# EAGLE design tvbgone3 (EAGLE 5.11)
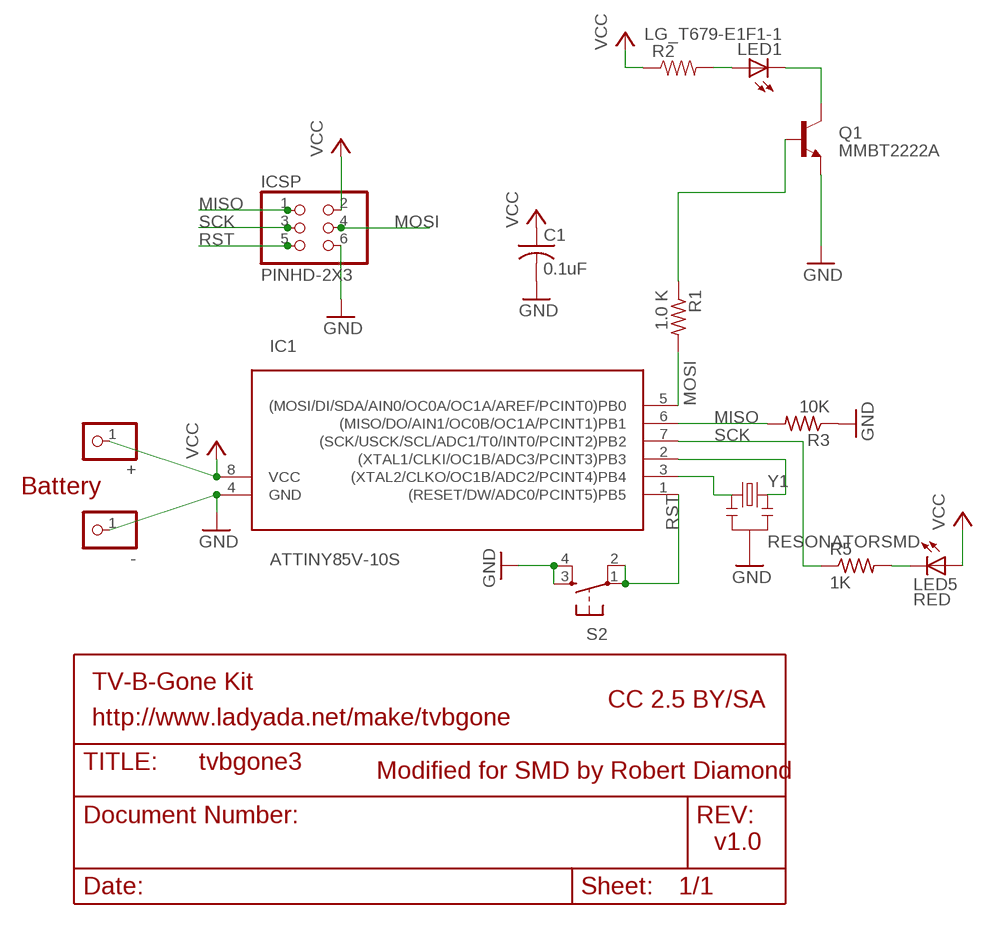
[diagram p0: schematic, sheet 1]

## Parts
+  PINHD-1X1  [1X01]
-  PINHD-1X1  [1X01]
C1  0.1uF  C-USC0603  [C0603]
IC1  ATTINY85V-10S  [SOIC8]
ICSP  PINHD-2X3  [2X3SMT]
LED1  LG_T679-E1F1-1  [PLCC2]
LED5  RED  LEDCHIP-LED0603  [CHIP-LED0603]
Q1  MMBT2222A  TRANSISTOR_NPNSOT23  [SOT23]
R1  1.0 K  R-US_R0603  [R0603]
R2  RESISTOR1206  [1206]
R3  10K  R-US_R0603  [R0603]
R5  1K  R-US_R0603  [R0603]
S2  TAC_SWITCHSMD  [TACTILE_SWITCH_SMD]
Y1  RESONATORSMD  [RESONATOR-SMD]

## Nets
GND: -.1 C1.2 IC1.4(GND) ICSP.6 Q1.2(E) R3.1 S2.3 S2.4 Y1.2
MISO: IC1.6((MISO/DO/AIN1/OC0B/OC1A/PCINT1)PB1) ICSP.1 R3.2
MOSI: IC1.5((MOSI/DI/SDA/AIN0/OC0A/OC1A/AREF/PCINT0)PB0) ICSP.4 R1.2
N$1: IC1.3((XTAL2/CLKO/OC1B/ADC2/PCINT4)PB4) Y1.1
N$2: IC1.2((XTAL1/CLKI/OC1B/ADC3/PCINT3)PB3) Y1.3
N$3: LED5.C R5.2
N$4: LED1.C Q1.3(C)
N$6: Q1.1(B) R1.1
N$7: LED1.A R2.2
RST: IC1.1((RESET/DW/ADC0/PCINT5)PB5) ICSP.5 S2.1 S2.2
SCK: IC1.7((SCK/USCK/SCL/ADC1/T0/INT0/PCINT2)PB2) ICSP.3 R5.1
VCC: +.1 C1.1 IC1.8(VCC) ICSP.2 LED5.A R2.1

## Notes on the sheet
- Battery
- TV-B-Gone Kit
- CC 2.5 BY/SA
- http://www.ladyada.net/make/tvbgone
- Modified for SMD by Robert Diamond
- v1.0

## Library data of the parts
+ - = ybox2:PINHD-1X1: PIN HEADER
C1 = rcl-ez:C-US: CAPACITOR, American symbol
IC1 = avr:ATTINY85: MICROCONTROLLER 8 Kbytes FLASH 512 bytes EEPROM 512 bytes RAM 4-channel 10 bit ADC USI
ICSP = adaprog:PINHD-2X3
LED1 = led:*_T679-?-1: LC TOPLED® Low Current LED Source: http://catalog.osram-os.com .. LG_LS_LY_T679_OBS.pdf; COLOR: green
LED5 = minimidi:LED: LED OSRAM: - CHIPLED LG R971, LG N971, LY N971, LG Q971, LY Q971, LO R971, LY R971 LH N974, LH R974 LS Q976, LO Q976, LY Q976 LO Q996 - Hyper CHIPLED LW Q18S LB Q993, LB Q99A, LB R99A - SideLED LS A670, LO A670, LY A670, LG A670, LP A670 LB A673, LV A673, LT A673, LW A673 LH A674 LY A675 LS A676, LA A676, LO A676, LY A676, LW A676 LS A679, LY A679, LG A679 - Hyper Micro SIDELED® LS Y876, LA Y876, LO Y876, LY Y876 LT Y87S - SmartLED LW L88C, LW L88S LB L89C, LB L89S, LG L890 LS L89K, LO L89K, LY L89K LS L896, LA L896, LO L896, LY L896 - TOPLED LS T670, LO T670, LY T670, LG T670, LP T670 LSG T670, LSP T670, LSY T670, LOP T670, LYG T670 LG T671, LOG T671, LSG T671 LB T673, LV T673, LT T673, LW T673 LH T674 LS T676, LA T676, LO T676, LY T676, LB T676, LH T676, LSB T676, LW T676 LB T67C, LV T67C, LT T67C, LS T67K, LO T67K, LY T67K, LW E67C LS E67B, LA E67B, LO E67B, LY E67B, LB E67C, LV E67C, LT E67C LW T67C LS T679, LY T679, LG T679 LS T770, LO T770, LY T770, LG T770, LP T770 LB T773, LV T773, LT T773, LW T773 LH T774 LS E675, LA E675, LY E675, LS T675 LS T776, LA T776, LO T776, LY T776, LB T776 LHGB T686 LT T68C, LB T68C - Hyper Mini TOPLED® LB M676 - Mini TOPLED Santana® LG M470 LS M47K, LO M47K, LY M47K Source: http://www.osram.convergy.de/
Q1 = SparkFun:TRANSISTOR_NPN: Transistor NPN BJT configuration in SOT23 package. MMBT2222 is the common NPN we use. Double check BCE configuration again layout.
R1 R3 R5 = rcl-ez:R-US_: RESISTOR, American symbol
R2 = SparkFun:RESISTOR: Resistor Basic schematic elements and footprints for 0603, 1206, and PTH 1/10th watt (small) resistors.
S2 = SparkFun:TAC_SWITCH: Momentary Switch Button commonly used for reset or general input. Spark Fun Electronics SKU : COM-00097
Y1 = SparkFun:RESONATOR: Resonator Small SMD resonator. This is the itty bitty 10/20MHz resonators with built in caps. CSTCE10M0G55 and CSTCE20M0V53. Footprint has been reviewed closely but hasn't been tested yet.

## Board
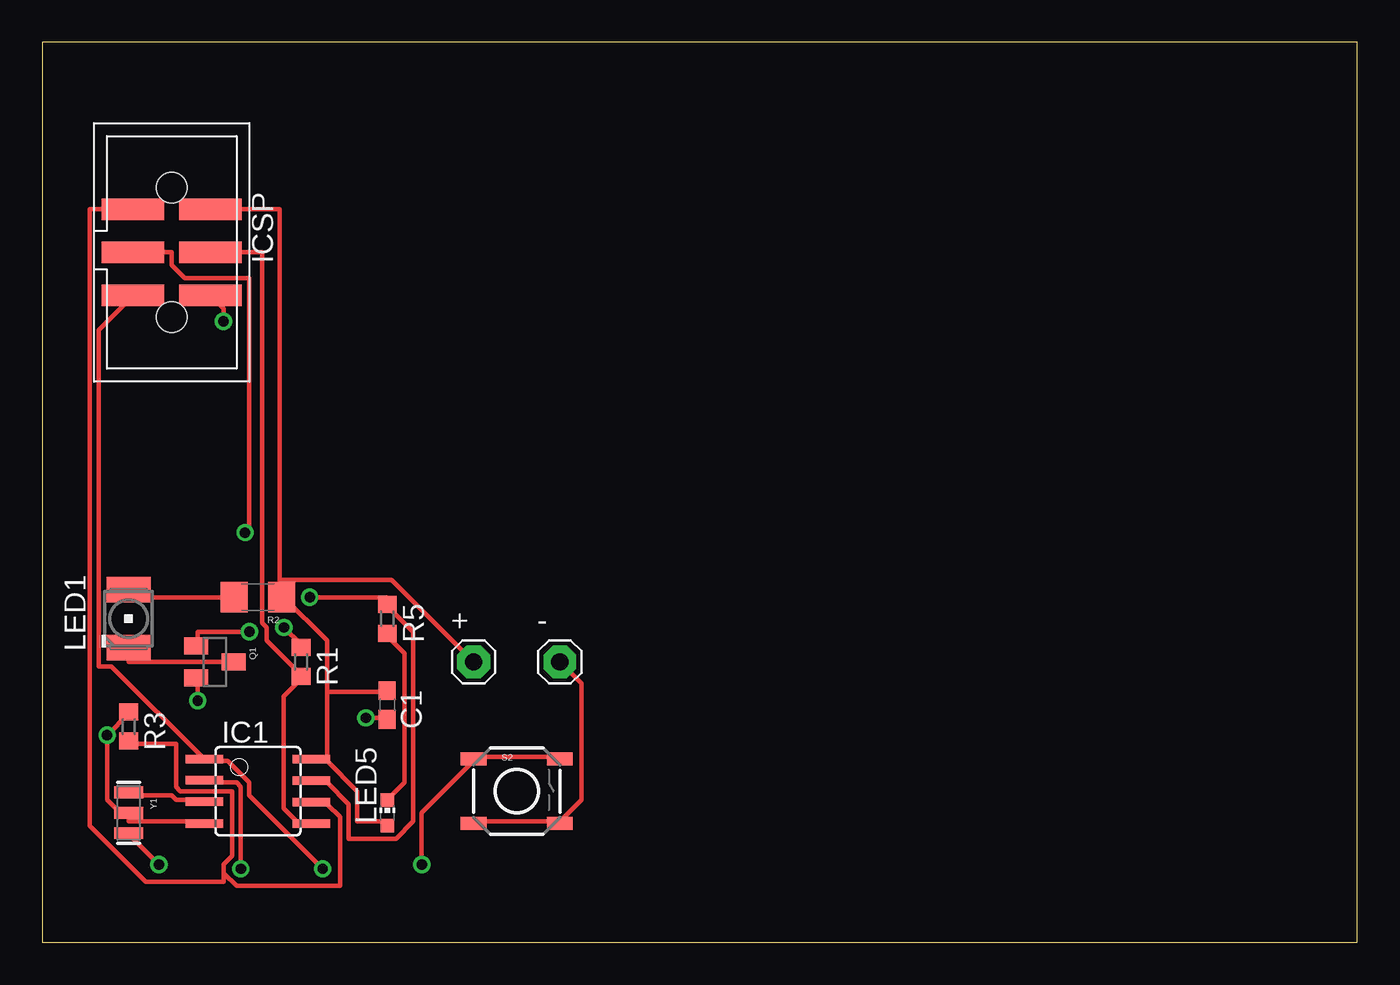
[diagram p1: board, top side]
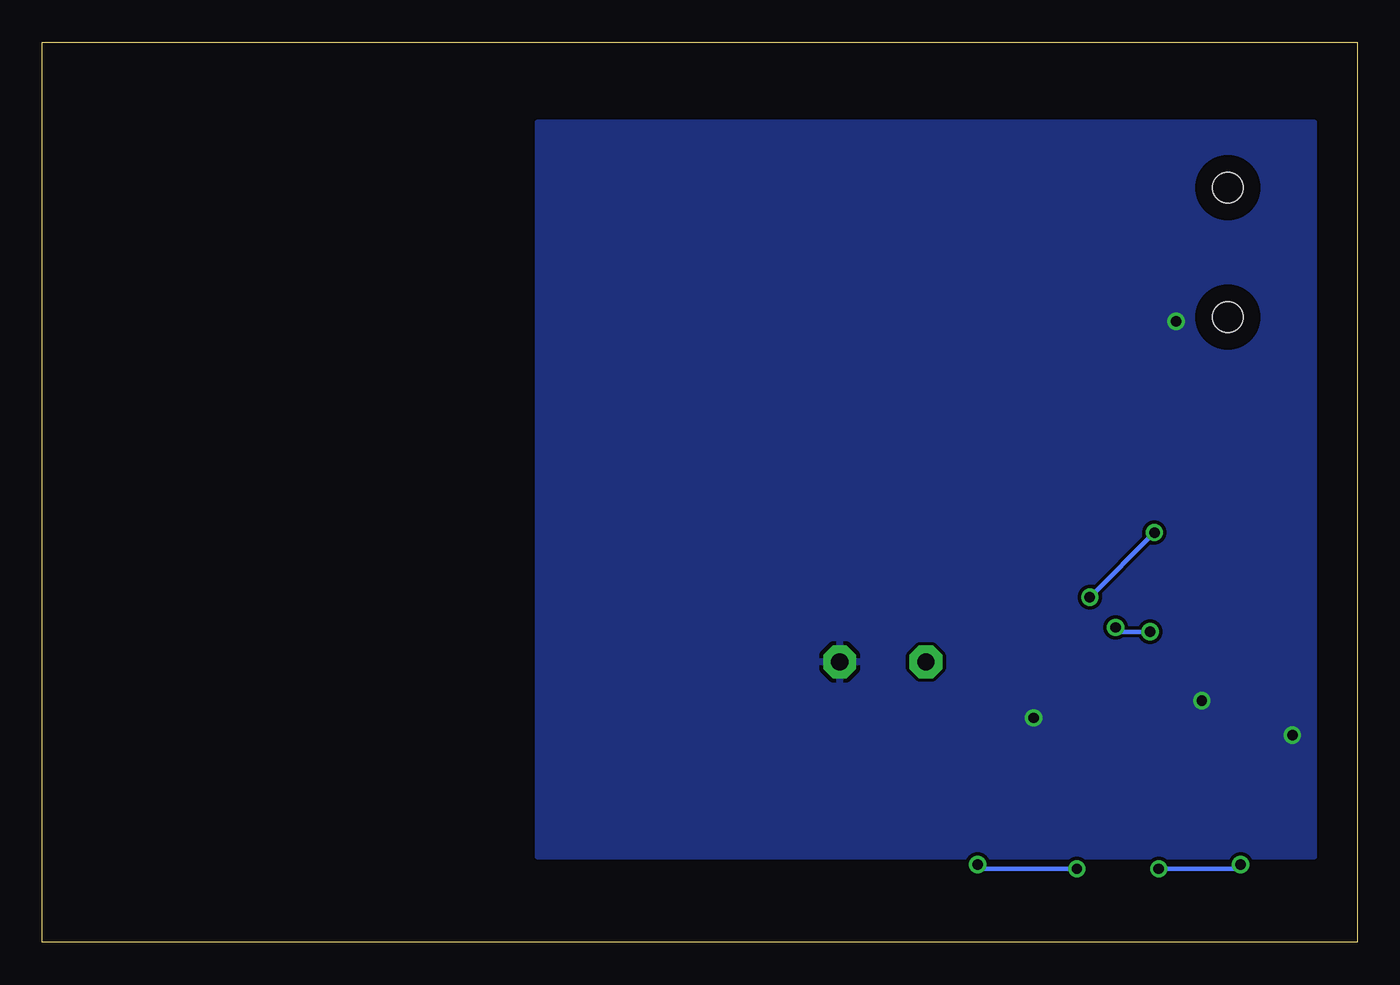
[diagram p2: board, bottom side, seen from below]

Size 77.45 x 53.01 mm. Coordinates in mm from the lower left corner, seen from the top.
Outline: 0,0 77.45,0 77.45,53.01 0,53.01 0,0
Copper layers (1*16): Top 0.035mm / dielectric 1.5mm / Bottom 0.035mm
Design rules "default": minimum track width 10mil, minimum drill 24mil, track to track 8mil, track to pad 8mil, pad to pad 8mil, via to via 8mil, smd to smd 8mil, copper to edge 40mil, drill to drill 8mil, minimum pad ring 10mil, minimum via ring 8mil, stop-mask expansion 4mil, vias tented up to drill 0mil, thermal gap 10mil

### Footprints (pad centres in the part's own frame; a part is rotated, then mirrored left to right if it is on the bottom)
1X01 = drill 1.016 pad 1.93 octagon: 1 0,0
C0603 = smd 1.1 x 1: 1 -0.85,0; 2 0.85,0
SOIC8 = smd 0.5 x 2.2: 1 -1.905,-3.154; 2 -0.645,-3.154; 3 0.625,-3.154; 4 1.895,-3.154; 5 1.905,3.154; 6 0.635,3.154; 7 -0.635,3.154; 8 -1.905,3.154
2X3SMT = smd 1.27 x 3.683: 1 -2.54,-2.286; 2 -2.54,2.286; 3 0,-2.286; 4 0,2.286; 5 2.54,-2.286; 6 2.54,2.286 | hole 1.778: -3.81,0; 3.81,0
PLCC2 = smd 2.6 x 1.5: A 0,1.7; C 0,-1.7
CHIP-LED0603 = smd 0.8 x 0.8: A 0,-0.75; C 0,0.75
SOT23 = smd 1 x 1.4: 1 -0.95,-1.1; 2 0.95,-1.1; 3 0,1.1
R0603 = smd 1 x 1.1: 1 -0.85,0; 2 0.85,0
1206 = smd 1.6 x 1.8: 1 -1.4,0; 2 1.4,0
TACTILE_SWITCH_SMD = smd 1.524 x 0.762: 1 -2.54,1.905; 2 2.54,1.905; 3 -2.54,-1.905; 4 2.54,-1.905
RESONATOR-SMD = smd 0.7 x 1.7: 1 -1.2,0; 2 0,0; 3 1.2,0

### Placement (x,y rotation side)
+  25.4,16.51 0 top
-  30.48,16.51 0 top
C1  20.32,13.97 270 top
IC1  12.7,8.89 270 top
ICSP  7.62,40.64 270 top
LED1  5.08,19.05 0 top
LED5  20.32,7.62 0 top
Q1  10.16,16.51 270 top
R1  15.24,16.51 270 top
R2  12.7,20.32 180 top
R3  5.08,12.7 270 top
R5  20.32,19.05 270 top
S2  27.94,8.89 0 top
Y1  5.08,7.62 270 top

### Tracks (layer width: path | path; a pad name or v marks a point on that pad's centre or on a via)
GND  (via drill 0.61)
  Top 0.254: R3.1 5.08,13.46 v3.81,12.19 3.81,8.38 4.57,7.62 Y1.2 5.08,7.11 9.4,7.11 IC1.4 | 30.48,7.11 25.4,7.11 S2.3 | v19.05,13.21 20.32,13.21 C1.2 | v9.14,14.22 9.14,15.49 Q1.2 | 30.48,7.11 31.75,8.38 31.75,15.24 -.1 | 30.48,7.11 S2.4 | ICSP.6 10.67,37.34 v10.67,36.58
  pour Bottom: 2.54,48.26 48.26,48.26 48.26,5.08 2.54,5.08
MISO
  Top 0.254: 10.67,4.06 10.67,4.57 11.18,5.08 11.18,8.89 8.13,8.89 7.87,9.14 7.87,11.68 5.08,11.68 R3.2 | 10.67,4.06 11.43,3.3 17.53,3.3 17.53,7.37 16.76,8.13 16,8.13 IC1.6 | ICSP.1 2.79,43.18 2.79,6.86 6.1,3.56 10.67,3.56 10.67,4.06
MOSI
  Top 0.254: IC1.5 15.75,7.11 14.99,7.11 14.22,7.87 14.22,14.48 15.24,15.49 R1.2 15.24,15.75 13.21,17.78 13.21,18.54 12.95,18.8 12.95,40.64 ICSP.4
N$1
  Top 0.254: Y1.1 5.08,8.64 7.62,8.64 7.87,8.38 9.4,8.38 IC1.3
N$2  (via drill 0.61)
  Top 0.254: v6.86,4.57 5.08,6.35 Y1.3 | v11.68,4.32 11.68,9.14 11.43,9.4 9.65,9.4 IC1.2
  Bottom 0.254: v6.86,4.57 7.11,4.32 v11.68,4.32
N$3
  Top 0.254: LED5.C 20.32,8.38 21.34,9.4 21.34,17.02 20.32,18.03 R5.2
N$4
  Top 0.254: Q1.3 5.08,16.51 LED1.C
N$6  (via drill 0.61)
  Top 0.254: v14.22,18.54 15.24,17.53 R1.1 | v12.19,18.29 9.14,18.29 9.14,17.53 Q1.1
  Bottom 0.254: v14.22,18.54 13.97,18.29 v12.19,18.29
N$7
  Top 0.254: R2.2 5.08,20.32 LED1.A
RST  (via drill 0.61)
  Top 0.254: S2.2 30.48,10.92 25.4,10.92 S2.1 25.4,10.67 22.35,7.62 v22.35,4.57 | ICSP.5 3.3,36.07 3.3,16.26 4.06,16.26 9.4,10.92 IC1.1 9.65,10.67 10.92,10.67 12.19,9.4 12.19,8.64 v16.51,4.32
  Bottom 0.254: v22.35,4.57 22.1,4.32 v16.51,4.32
SCK  (via drill 0.61)
  Top 0.254: IC1.7 16,9.4 16.76,9.4 18.03,8.13 18.03,6.1 20.83,6.1 21.84,7.11 21.84,18.29 20.32,19.81 R5.1 20.32,20.32 v15.75,20.32 | ICSP.3 7.62,40.64 7.62,39.88 8.38,39.12 12.19,39.12 12.19,24.38 v11.94,24.13
  Bottom 0.254: v15.75,20.32 v11.94,24.13
VCC
  Top 0.254: 16.76,10.67 18.54,8.89 18.54,7.11 20.32,7.11 LED5.A | 16.76,10.67 16,10.67 IC1.8 16.76,10.67 | 16.76,14.73 20.32,14.73 C1.1 | 16.76,10.67 16.76,14.73 | 16.76,14.73 16.76,17.78 14.22,20.32 R2.1 13.97,20.32 13.97,21.34 | ICSP.2 13.97,43.18 13.97,21.34 | +.1 20.57,21.34 13.97,21.34